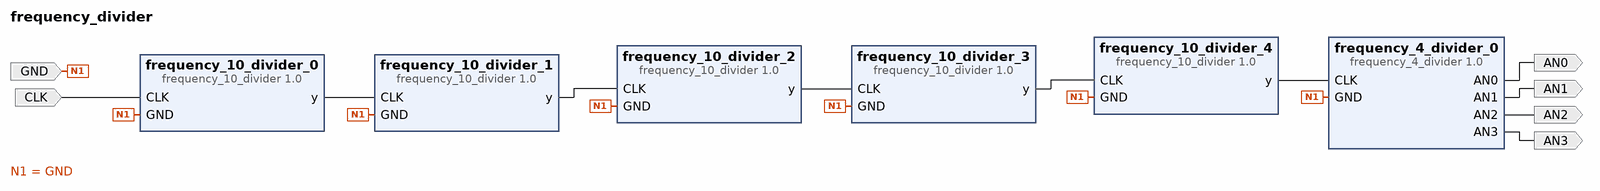
[diagram p0: block diagram of the top level]
# Vivado block design frequency_divider, xc7a35tcpg236-1, Vivado 2021.1
create_bd_design frequency_divider

create_bd_port -dir I GND
create_bd_port -dir I CLK
create_bd_port -dir O AN0
create_bd_port -dir O AN1
create_bd_port -dir O AN2
create_bd_port -dir O AN3

create_bd_cell -type ip -vlnv xilinx.com:user:frequency_10_divider:1.0 frequency_10_divider_0
create_bd_cell -type ip -vlnv xilinx.com:user:frequency_10_divider:1.0 frequency_10_divider_1
create_bd_cell -type ip -vlnv xilinx.com:user:frequency_10_divider:1.0 frequency_10_divider_2
create_bd_cell -type ip -vlnv xilinx.com:user:frequency_10_divider:1.0 frequency_10_divider_3
create_bd_cell -type ip -vlnv xilinx.com:user:frequency_10_divider:1.0 frequency_10_divider_4
create_bd_cell -type ip -vlnv xilinx.com:user:frequency_4_divider:1.0 frequency_4_divider_0

# ---- connections ----

connect_bd_net [get_bd_ports CLK] [get_bd_pins frequency_10_divider_0/CLK]
connect_bd_net [get_bd_ports GND] \
  [get_bd_pins frequency_10_divider_0/GND] [get_bd_pins frequency_10_divider_1/GND] [get_bd_pins frequency_10_divider_2/GND] \
  [get_bd_pins frequency_10_divider_3/GND] [get_bd_pins frequency_10_divider_4/GND] [get_bd_pins frequency_4_divider_0/GND]
connect_bd_net [get_bd_pins frequency_10_divider_0/y] [get_bd_pins frequency_10_divider_1/CLK]
connect_bd_net [get_bd_pins frequency_10_divider_1/y] [get_bd_pins frequency_10_divider_2/CLK]
connect_bd_net [get_bd_pins frequency_10_divider_2/y] [get_bd_pins frequency_10_divider_3/CLK]
connect_bd_net [get_bd_pins frequency_10_divider_3/y] [get_bd_pins frequency_10_divider_4/CLK]
connect_bd_net [get_bd_pins frequency_10_divider_4/y] [get_bd_pins frequency_4_divider_0/CLK]
connect_bd_net [get_bd_pins frequency_4_divider_0/AN0] [get_bd_ports AN0]
connect_bd_net [get_bd_pins frequency_4_divider_0/AN1] [get_bd_ports AN1]
connect_bd_net [get_bd_pins frequency_4_divider_0/AN2] [get_bd_ports AN2]
connect_bd_net [get_bd_pins frequency_4_divider_0/AN3] [get_bd_ports AN3]

validate_bd_design
save_bd_design
